# Altium project EVK-NORA-W1.PrjPcb (part 2 of 3)

## Sheet EVK-NORA-W1_SCHEM_0003_Shield_Conn.SchDoc
size B; Date: 7/24/2020; CompanyName: U-blox; DrawnBy: EMOO; Engineer: EMOO; Organization: U-blox; Address1: 3950 Fairview Industrial Dr SE #100; Address2: Salem, OR 97302; SheetNumber: 5; SheetTotal: 6; SheetSize: B; SheetTitle: Connectors
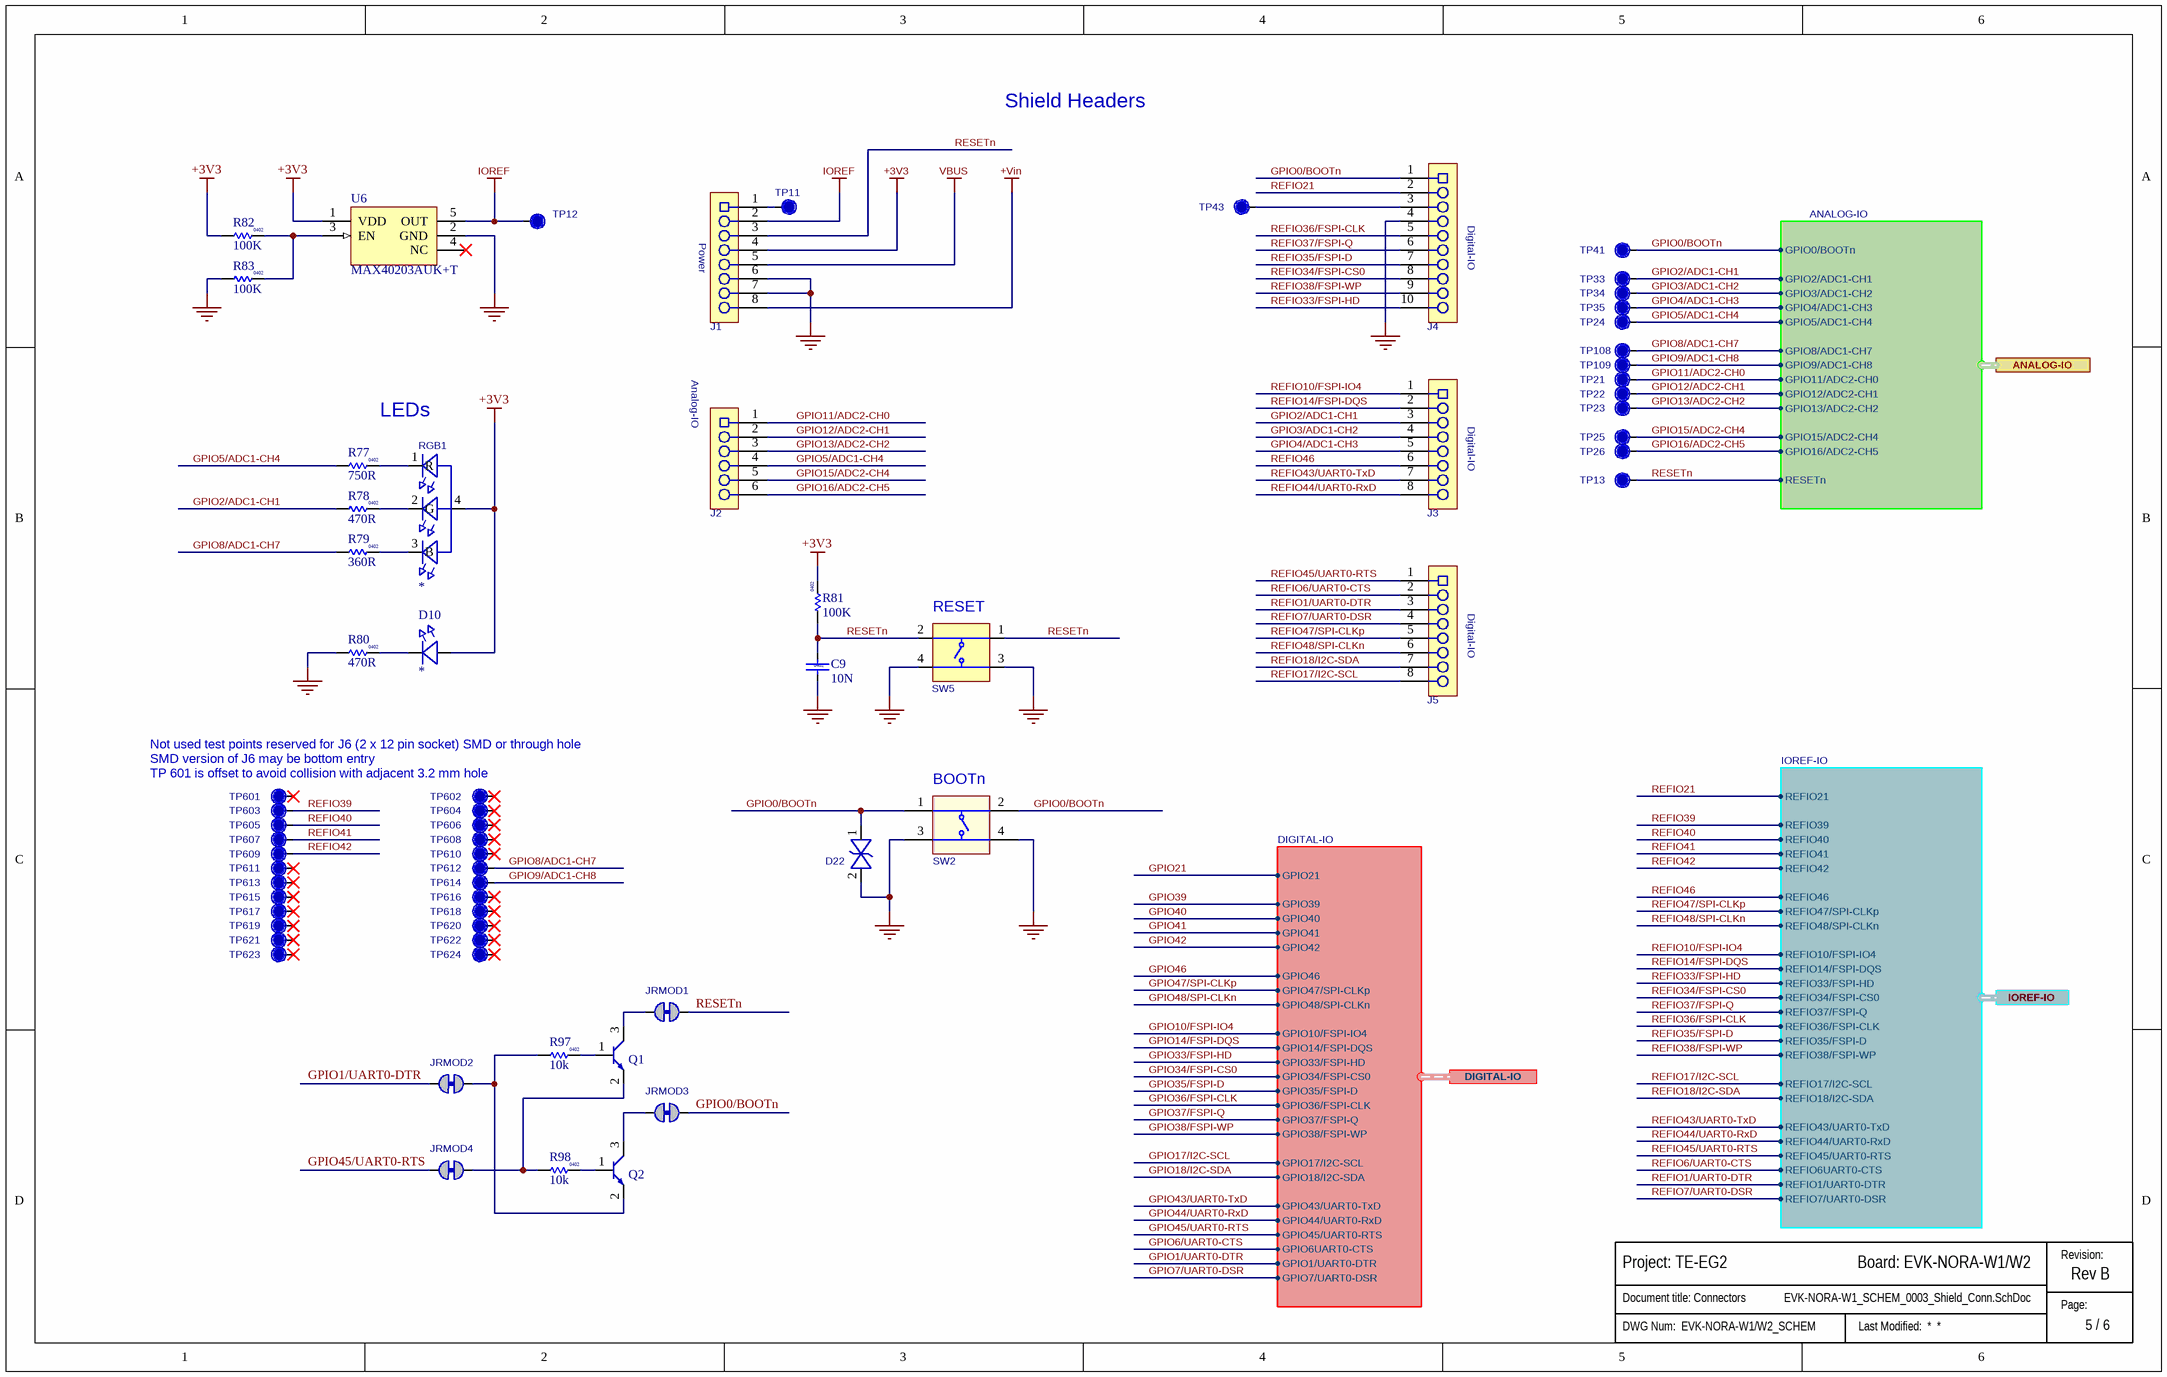
[diagram p3: EVK-NORA-W1_SCHEM_0003_Shield_Conn.SchDoc]

### Parts
(Parts that share a designator on the sheet are numbered #1, #2 ... from top to bottom, then left to right.)
?#5  (no value)  (graphical)
C9  value 10N  Size: 0402  [Cap 0402]
D10  (no value)  [LED-0603]
D22  110-00019  [SOD-923]  (value not drawn)
J1  (no value)  [SKT-0.1P-SSM-108-L-SV]
J2  (no value)  [SKT-0.1P-SSM-106-L-SV]
J3  (no value)  [SKT-0.1P-SSM-108-L-SV]
J4  (no value)  [SKT-0.1P-SSM-110-L-SV]
J5  (no value)  [SKT-0.1P-SSM-108-L-SV]
JRMOD1  Solderbridge-ShortDNP  [Solderbridge-Short]  (value not drawn)  (net tie, no BOM)
JRMOD2  Solderbridge-ShortDNP  [Solderbridge-Short]  (value not drawn)  (net tie, no BOM)
JRMOD3  Solderbridge-ShortDNP  [Solderbridge-Short]  (value not drawn)  (net tie, no BOM)
JRMOD4  Solderbridge-ShortDNP  [Solderbridge-Short]  (value not drawn)  (net tie, no BOM)
Q1  (no value)  [SOT-23]
Q2  (no value)  [SOT-23]
R77  value 750R  Size: 0402  [RES 0402 HD]
R78  value 470R  Size: 0402  [RES 0402 HD]
R79  value 360R  Size: 0402  [RES 0402 HD]
R80  value 470R  Size: 0402  [RES 0402 HD]
R81  value 100K  Size: 0402  [RES 0402 HD]
R82  value 100K  Size: 0402  [RES 0402 HD]
R83  value 100K  Size: 0402  [RES 0402 HD]
R97  value 10k  Size: 0402  [RES 0402 HD]
R98  value 10k  Size: 0402  [RES 0402 HD]
RGB1  (no value)  [LED_1616]
SW2  (no value)  [SW_TACT_SMT_6mm]
SW5  135-00002  [SW_TACT_SMT_6mm]  (value not drawn)
TP11  TP  [TP10R]  (value not drawn)  (no BOM)
TP12  TP  [TP10R]  (value not drawn)  (no BOM)
TP13  TP  [TP10R]  (value not drawn)  (no BOM)
TP21  TP  [TP10R]  (value not drawn)  (no BOM)
TP22  TP  [TP10R]  (value not drawn)  (no BOM)
TP23  TP  [TP10R]  (value not drawn)  (no BOM)
TP24  TP  [TP10R]  (value not drawn)  (no BOM)
TP25  TP  [TP10R]  (value not drawn)  (no BOM)
TP26  TP  [TP10R]  (value not drawn)  (no BOM)
TP33  TP  [TP10R]  (value not drawn)  (no BOM)
TP34  TP  [TP10R]  (value not drawn)  (no BOM)
TP35  TP  [TP10R]  (value not drawn)  (no BOM)
TP41  TP  [TP10R]  (value not drawn)  (no BOM)
TP43  TP  [TP10R]  (value not drawn)  (no BOM)
TP108  TP  [TP10R]  (value not drawn)  (no BOM)
TP109  TP  [TP10R]  (value not drawn)  (no BOM)
TP601  TP  [TP10R]  (value not drawn)  (no BOM)
TP602  TP  [TP10R]  (value not drawn)  (no BOM)
TP603  TP  [TP10R]  (value not drawn)  (no BOM)
TP604  TP  [TP10R]  (value not drawn)  (no BOM)
TP605  TP  [TP10R]  (value not drawn)  (no BOM)
TP606  TP  [TP10R]  (value not drawn)  (no BOM)
TP607  TP  [TP10R]  (value not drawn)  (no BOM)
TP608  TP  [TP10R]  (value not drawn)  (no BOM)
TP609  TP  [TP10R]  (value not drawn)  (no BOM)
TP610  TP  [TP10R]  (value not drawn)  (no BOM)
TP611  TP  [TP10R]  (value not drawn)  (no BOM)
TP612  TP  [TP10R]  (value not drawn)  (no BOM)
TP613  TP  [TP10R]  (value not drawn)  (no BOM)
TP614  TP  [TP10R]  (value not drawn)  (no BOM)
TP615  TP  [TP10R]  (value not drawn)  (no BOM)
TP616  TP  [TP10R]  (value not drawn)  (no BOM)
TP617  TP  [TP10R]  (value not drawn)  (no BOM)
TP618  TP  [TP10R]  (value not drawn)  (no BOM)
TP619  TP  [TP10R]  (value not drawn)  (no BOM)
TP620  TP  [TP10R]  (value not drawn)  (no BOM)
TP621  TP  [TP10R]  (value not drawn)  (no BOM)
TP622  TP  [TP10R]  (value not drawn)  (no BOM)
TP623  TP  [TP10R]  (value not drawn)  (no BOM)
TP624  TP  [TP10R]  (value not drawn)  (no BOM)
U6  Manufacturer Part Number 1: MAX40203AUK+T  [SOT-23-5]

### Ports
ANALOG-IO (harness ANALOG-IO), DIGITAL-IO (harness DIGITAL-IO), IOREF-IO (harness IOREF-IO)

### Harnesses
ANALOG-IO: GPIO0/BOOTn, GPIO11/ADC2-CH0, GPIO12/ADC2-CH1, GPIO13/ADC2-CH2, GPIO15/ADC2-CH4, GPIO16/ADC2-CH5, GPIO2/ADC1-CH1, GPIO3/ADC1-CH2, GPIO4/ADC1-CH3, GPIO5/ADC1-CH4, GPIO8/ADC1-CH7, GPIO9/ADC1-CH8, RESETn
IOREF-IO: REFIO1/UART0-DTR, REFIO10/FSPI-IO4, REFIO14/FSPI-DQS, REFIO17/I2C-SCL, REFIO18/I2C-SDA, REFIO21, REFIO33/FSPI-HD, REFIO34/FSPI-CS0, REFIO37/FSPI-Q, REFIO36/FSPI-CLK, REFIO35/FSPI-D, REFIO38/FSPI-WP, REFIO39, REFIO40, REFIO41, REFIO42, REFIO43/UART0-TxD, REFIO44/UART0-RxD, REFIO45/UART0-RTS, REFIO46, REFIO47/SPI-CLKp, REFIO48/SPI-CLKn, REFIO6UART0-CTS, REFIO7/UART0-DSR
DIGITAL-IO: GPIO1/UART0-DTR, GPIO6UART0-CTS, GPIO7/UART0-DSR, GPIO10/FSPI-IO4, GPIO14/FSPI-DQS, GPIO17/I2C-SCL, GPIO18/I2C-SDA, GPIO21, GPIO33/FSPI-HD, GPIO34/FSPI-CS0, GPIO35/FSPI-D, GPIO36/FSPI-CLK, GPIO37/FSPI-Q, GPIO38/FSPI-WP, GPIO39, GPIO40, GPIO41, GPIO42, GPIO43/UART0-TxD, GPIO44/UART0-RxD, GPIO45/UART0-RTS, GPIO46, GPIO47/SPI-CLKp, GPIO48/SPI-CLKn

### Nets
+3V3: D10.2(A) J1.4 R81.2 R82.1 RGB1.4(A) U6.1(VDD)
+Vin: J1.8
GND: C9.2 D22.2 J1.6 J1.7 J4.4 R80.1 R83.1 SW2.3 SW2.4 SW5.3(T3) SW5.4(T3) U6.2(GND)
IOREF: J1.2 TP12.1 U6.5(OUT)
VBUS: J1.5
GPIO0/BOOTn: D22.1 J4.1 JRMOD3.1 SW2.1 SW2.2 TP41.1 ; port ANALOG-IO.GPIO0/BOOTn
GPIO1/UART0-DTR: JRMOD2.2 ; port DIGITAL-IO.GPIO1/UART0-DTR
GPIO2/ADC1-CH1: J3.3 R78.1 TP33.1 ; port ANALOG-IO.GPIO2/ADC1-CH1
GPIO3/ADC1-CH2: J3.4 TP34.1 ; port ANALOG-IO.GPIO3/ADC1-CH2
GPIO4/ADC1-CH3: J3.5 TP35.1 ; port ANALOG-IO.GPIO4/ADC1-CH3
GPIO5/ADC1-CH4: J2.4 R77.1 TP24.1 ; port ANALOG-IO.GPIO5/ADC1-CH4
GPIO8/ADC1-CH7: R79.1 TP108.1 TP612.1 ; port ANALOG-IO.GPIO8/ADC1-CH7
GPIO9/ADC1-CH8: TP109.1 TP614.1 ; port ANALOG-IO.GPIO9/ADC1-CH8
GPIO11/ADC2-CH0: J2.1 TP21.1 ; port ANALOG-IO.GPIO11/ADC2-CH0
GPIO12/ADC2-CH1: J2.2 TP22.1 ; port ANALOG-IO.GPIO12/ADC2-CH1
GPIO13/ADC2-CH2: J2.3 TP23.1 ; port ANALOG-IO.GPIO13/ADC2-CH2
GPIO15/ADC2-CH4: J2.5 TP25.1 ; port ANALOG-IO.GPIO15/ADC2-CH4
GPIO16/ADC2-CH5: J2.6 TP26.1 ; port ANALOG-IO.GPIO16/ADC2-CH5
GPIO45/UART0-RTS: JRMOD4.2 ; port DIGITAL-IO.GPIO45/UART0-RTS
REFIO1/UART0-DTR: J5.3 ; port IOREF-IO.REFIO1/UART0-DTR
REFIO6/UART0-CTS: J5.2 ; port IOREF-IO.REFIO6UART0-CTS
REFIO7/UART0-DSR: J5.4 ; port IOREF-IO.REFIO7/UART0-DSR
REFIO10/FSPI-IO4: J3.1 ; port IOREF-IO.REFIO10/FSPI-IO4
REFIO14/FSPI-DQS: J3.2 ; port IOREF-IO.REFIO14/FSPI-DQS
REFIO17/I2C-SCL: J5.8 ; port IOREF-IO.REFIO17/I2C-SCL
REFIO18/I2C-SDA: J5.7 ; port IOREF-IO.REFIO18/I2C-SDA
REFIO21: J4.2 ; port IOREF-IO.REFIO21
REFIO33/FSPI-HD: J4.10 ; port IOREF-IO.REFIO33/FSPI-HD
REFIO34/FSPI-CS0: J4.8 ; port IOREF-IO.REFIO34/FSPI-CS0
REFIO35/FSPI-D: J4.7 ; port IOREF-IO.REFIO35/FSPI-D
REFIO36/FSPI-CLK: J4.5 ; port IOREF-IO.REFIO36/FSPI-CLK
REFIO37/FSPI-Q: J4.6 ; port IOREF-IO.REFIO37/FSPI-Q
REFIO38/FSPI-WP: J4.9 ; port IOREF-IO.REFIO38/FSPI-WP
REFIO39: TP603.1 ; port IOREF-IO.REFIO39
REFIO40: TP605.1 ; port IOREF-IO.REFIO40
REFIO41: TP607.1 ; port IOREF-IO.REFIO41
REFIO42: TP609.1 ; port IOREF-IO.REFIO42
REFIO43/UART0-TxD: J3.7 ; port IOREF-IO.REFIO43/UART0-TxD
REFIO44/UART0-RxD: J3.8 ; port IOREF-IO.REFIO44/UART0-RxD
REFIO45/UART0-RTS: J5.1 ; port IOREF-IO.REFIO45/UART0-RTS
REFIO46: J3.6 ; port IOREF-IO.REFIO46
REFIO47/SPI-CLKp: J5.5 ; port IOREF-IO.REFIO47/SPI-CLKp
REFIO48/SPI-CLKn: J5.6 ; port IOREF-IO.REFIO48/SPI-CLKn
RESETn: C9.1 J1.3 JRMOD1.1 R81.1 SW5.1(T1) SW5.2(T2) TP13.1 ; port ANALOG-IO.RESETn
NetD10_1: D10.1(C) R80.2
NetJ1_1: J1.1 TP11.1
NetJ4_3: J4.3 TP43.1
NetJRMOD1_2: JRMOD1.2 Q1.3(C)
NetJRMOD2_1: JRMOD2.1 Q2.2(E) R97.1
NetJRMOD3_2: JRMOD3.2 Q2.3(C)
NetJRMOD4_1: JRMOD4.1 Q1.2(E) R98.1
NetQ1_1: Q1.1(B) R97.2
NetQ2_1: Q2.1(B) R98.2
NetR77_2: R77.2 RGB1.1(R)
NetR78_2: R78.2 RGB1.2(G)
NetR79_2: R79.2 RGB1.3(B)
NetR82_2: R82.2 R83.2 U6.3(EN)

Not connected (* = marked no-connect by the designer): TP601 1*; TP602 1*; TP604 1*; TP606 1*; TP608 1*; TP610 1*; TP611 1*; TP613 1*; TP615 1*; TP616 1*; TP617 1*; TP618 1*; TP619 1*; TP620 1*; TP621 1*; TP622 1*; TP623 1*; TP624 1*; U6 4(NC)*

### Notes on the sheet
- Shield Headers
- (near J1) Power
- (near J4) Digital-IO
- LEDs
- (near J2) Analog-IO
- (near J3) Digital-IO
- (near SW5) RESET
- (near J5) Digital-IO
- Not used test points reserved for J6 (2 x 12 pin socket) SMD or through hole
- SMD version of J6 may be bottom entry
- TP 601 is offset to avoid collision with adjacent 3.2 mm hole
- (near SW2) BOOTn
- Revision:
- Page:

### Library data of the parts
?#5 = Sub_Title_Block: as ?#3 on sheet EVK-NORA-W1_SCHEM_0001_NORA_W1_Module
C9 = UBXH01-0023025: CAP CER X7R 0402 10N 10% 16V; Manufacturer: Murata Manufacturing Company, Ltd.; Manufacturer P/N: GRM155R71C103KA01; Editor: roland.rust; Released by: anthony.gergis; Env: ROHS; Permitted Use: Volume Products; Perferred: PREF; Mfg P/N Status: NRND; Mfg P/N Split: 100; Mfg P/N Released: Yes; Part Number: UBXH01-0023025; Tolerance: 10%; Max Voltage: 16V; Min Operating Temp: -55°C; Max Operating Temp: 125°C; Part Type: Capacitor; Release Data: 2021-02-16 13:14:11.218378; UBX Wiki: https://wiki.u-blox.com/bin/view/Operations/PartDetails?index=5491; RefDes: C; Manufacturer 2: Samsung Electro-Mechanics; Manufacturer P/N 2: CL05B103KO5NNNC; Mfg P/N Status 2: Active; Mfg P/N Split 2: 0; Mfg P/N Released 2: Yes; Mfg P/N Datasheet 2: https://wiki.u-blox.com/bin/view/Generic/Docs/DocumentSummary?index=28567
D10 = UBXH11-0000018: LED CHIP 0603 LOW CURRENT OSRAM 0.002A GREEN 2.2V 2mA; Manufacturer P/N: LG L29K-G2J1-24; Editor: johann.furrer; Released by: martin.grasse; Env: ROHS; Permitted Use: Volume Products; Perferred: PREF; Mfg P/N Status: Active; Mfg P/N Split: 100; Mfg P/N Released: Yes; Color: *; Part Number: UBXH11-0000018; Value: GREEN; Max Voltage: 2.2V; Max Current: 2mA; Size: 0603; Min Operating Temp: -40°C; Max Operating Temp: 85°C; Part Type: LED; Release Data: 2018-01-09 15:31:38.754561; UBX Wiki: https://wiki.u-blox.com/bin/view/Operations/PartDetails?index=20619; RefDes: DS; Manufacturer: Osram; Mfg P/N Datasheet: https://wiki.u-blox.com/bin/view/Generic/Docs/DocumentSummary?index=20620
D22 = 110-00019: ESD9B3.3ST5G; Part Name: Diode TVS 3.3V SOD-923; Part_Type: Diode; Manufacturer: ON Semiconductor; Item_Phase: Preliminary; Body Size: 0.8mm x 0.6mm; Component Mounting Type: SMT; Diode Type: TVS; Use in new designs: Yes; Voltage: 3.3V; Part Number: 110-00019; Manufacturer P/N: ESD9B3.3ST5G; Supplier 1: Digi-Key; Supplier Part Number 1: ESD9B3.3ST5GOSCT-ND; Arena Link: https://app.bom.com/a/4M5DJQ9Q9SR7DV4H?v=spec.summary; Height: 0.4mm; MFG Package: SOD-923; Package Type: SOD; Pins: 2
J1 J3 J5 = 130-00102: Socket Strip 0.1" 8 Pin 1Row SMD Black; Manufacturer 1: Seeed Technology; Manufacturer Part Number 1: Rigado 130-00102; Part Name: CON SKT Strip 0.1" 8Pin 1Row SMD Black; Item Phase: In Production; Use in new designs: Yes; Voltage: 572VDC; UBX Code: None; Part Number: 130-00102; Supplier 1: Seeed Technology; Supplier Part Number 1: Rigado 130-00102; Diameter: None; Height: 7.37mm; Max Operating Temp: 105; Min Operating Temp: -55; Pins: 8; Revision: 0C; Manufacturer 2: Samtec; Manufacturer Part Number 2: SSM-108-F-SV-P-TR; Supplier 2: Avnet; Supplier Part Number 2: SSM-108-F-SV-P-TR
J2 = 130-00103: Socket Strip 0.1" 6Pin 1Row SMD Black; Manufacturer 1: Seeed Technology; Manufacturer Part Number 1: Rigado 130-00103; Part Name: CON SKT Strip 0.1" 6Pin 1Row SMD Black; Item Phase: In Production; Use in new designs: Yes; Voltage: 572VDC; UBX Code: None; Manufacturer P/N: *; Part Number: 130-00103; Supplier 1: Seeed Technology; Supplier Part Number 1: Rigado 130-00103; Diameter: None; Height: 7.37mm; Max Operating Temp: 105; Min Operating Temp: -55; Pins: 6; Revision: 0C; Manufacturer 2: Samtec; Manufacturer Part Number 2: SSM-106-F-SV-P-TR; Supplier 2: Avnet; Supplier Part Number 2: SSM-106-F-SV-P-TR
J4 = 130-00101: Socket Strip 0.1" 10Pin 1Row SMD Black; Manufacturer 1: Seeed Technology; Manufacturer Part Number 1: Rigado 130-00101; Part Name: CON SKT Strip 0.1" 10Pin 1Row SMD Black; Item Phase: In Production; Use in new designs: Yes; Voltage: 572VDC; UBX Code: None; Part Number: 130-00101; Supplier 1: Seeed Technology; Supplier Part Number 1: Rigado 130-00101; Diameter: None; Height: 7.37mm; Max Operating Temp: 105; Min Operating Temp: -55; Pins: 10; Revision: 0C; Manufacturer 2: Samtec; Manufacturer Part Number 2: SSM-110-F-SV-P-TR; Supplier 2: Avnet; Supplier Part Number 2: SSM-110-F-SV-P-TR
JRMOD1-JRMOD4 = Solderbridge-Short: Added By: Paul B; Part Number: Solderbridge-Short; Height: 0; DNP: DNP; Added Date: 12/2/2015
Q1 Q2 = UBXH20-0000052: GENERAL PURPOSE SINGLE NPN TRANSISTOR SOT-23 45V 800mA; Manufacturer: ON Semiconductor; Value: BCW66GLT3G; Editor: jaakko.jussila; Released by: alex.claville; Env: ROHS; Permitted Use: Support Products; Perferred: PREF; Mfg P/N Status: Active; Mfg P/N Split: 100; Mfg P/N Released: Yes; Part Number: UBXH20-0000052; Max Voltage: 45V; Max Current: 800mA; Min Operating Temp: -55°C; Max Operating Temp: 155°C; Part Type: Transistor; Release Data: 2019-05-06T10:58:51; UBX Wiki: https://wiki.u-blox.com/bin/view/Operations/PartDetails?index=26834; RefDes: Q; Manufacturer P/N: BCW66GLT3G; Mfg P/N Datasheet: https://wiki.u-blox.com/bin/view/Generic/Docs/DocumentSummary?index=26837
R77 = UBXH18-0008046: RES THICK FILM CHIP 0402 750R 5% 100mW; Manufacturer: Panasonic; Manufacturer P/N: ERJ2GEJ751X; Editor: jaka.bevk; Released by: erian.bezhani; Env: ROHS; Permitted Use: Volume Products; Perferred: PREF; Mfg P/N Status: Active; Mfg P/N Split: 100; Mfg P/N Released: Yes; Part Number: UBXH18-0008046; Tolerance: 5%; Max Power: 100mW; Part Type: Resistor; Release Data: 2014-10-03 09:31:33.687559; UBX Wiki: https://wiki.u-blox.com/bin/view/Operations/PartDetails?index=6935; RefDes: R; Mfg P/N Datasheet: https://wiki.u-blox.com/bin/view/Generic/Docs/DocumentSummary?index=21267
R78 R80 = UBXH18-0008041: RES THICK FILM CHIP 0402 470R 5% 100mW; Manufacturer: ROHM; Manufacturer P/N: MCR01MZPJ471; Editor: roland.rust; Env: ROHS; Permitted Use: Volume Products; Perferred: PREF; Mfg P/N Status: Active; Mfg P/N Split: 100; Mfg P/N Released: Yes; Part Number: UBXH18-0008041; Tolerance: 5%; Max Power: 100mW; Part Type: Resistor; Released by: roland.rust; Release Data: 2009-04-24 14:36:39; UBX Wiki: https://wiki.u-blox.com/bin/view/Operations/PartDetails?index=6926; RefDes: R; Manufacturer 2: KOA; Manufacturer P/N 2: RK73B1ETTP471J; Mfg P/N Status 2: Active; Mfg P/N Split 2: 0; Mfg P/N Released 2: Yes; Manufacturer 3: YAGEO; Manufacturer P/N 3: 2322_705_87471_L; Mfg P/N Status 3: NRND; Mfg P/N Split 3: 0; Mfg P/N Released 3: Yes
R79 = UBXH18-0000216: RES THICK FILM CHIP 0402 360R 1% 63mW; Manufacturer: KOA; Manufacturer P/N: RK73H1ETTP3600F; Editor: michael.hein; Released by: vasyl.dykyy; Env: ROHS; Permitted Use: Volume Products; Perferred: PREF; Mfg P/N Status: Active; Mfg P/N Split: 100; Mfg P/N Released: Yes; Part Number: UBXH18-0000216; Tolerance: 1%; Max Power: 63mW; Part Type: Resistor; Release Data: 2015-10-02 11:55:45.476057; Automotive: Yes; UBX Wiki: https://wiki.u-blox.com/bin/view/Operations/PartDetails?index=23306; RefDes: R; Mfg P/N Datasheet: https://wiki.u-blox.com/bin/view/Generic/Docs/DocumentSummary?index=8222
R81-R83 = UBXH18-0008097: RES THICK FILM CHIP 0402 100K 5% 100mW; Manufacturer: YAGEO; Manufacturer P/N: 2322_705_70104_L; Editor: roland.rust; Env: ROHS; Permitted Use: Volume Products; Perferred: PREF; Mfg P/N Status: NRND; Mfg P/N Split: 100; Mfg P/N Released: Yes; Part Number: UBXH18-0008097; Tolerance: 5%; Max Power: 100mW; Part Type: Resistor; Released by: roland.rust; Release Data: 2005-07-22 13:59:44; UBX Wiki: https://wiki.u-blox.com/bin/view/Operations/PartDetails?index=7020; RefDes: R; Manufacturer 2: KOA; Manufacturer P/N 2: RK73B1ETTD104J; Mfg P/N Status 2: NRND; Mfg P/N Split 2: 0; Mfg P/N Released 2: Yes
R97 R98 = 180-00024: Resistor 10k ohm 1% 1/16W, 0402; Manufacturer 1: Samsung Electro-Mechanics America, Inc; Manufacturer Part Number 1: RC1005F103CS; Part Name: RES SMD 10K OHM 1% 1/16W 0402; Item Phase: In Production; Tolerance: +/- 1%; Use in new designs: Yes; UBX Code: None; Part Number: 180-00024; Supplier 1: Digi-Key; Supplier Part Number 1: 1276-3431-1-ND; Manufacturer 2: Hong Kong Resistors Manufactory; Manufacturer Part Number 2: RCT0210KFLF; Supplier 2: None; Supplier Part Number 2: None; Height: 0.4mm; Max Operating Temp: 155; Min Operating Temp: -55; Pins: 2; Power: 1/16W; Revision: 0E; Voltage: N/A
RGB1 = 115-00026: LED RGB SMT 0606; Manufacturer 1: Lite-On Inc; Manufacturer Part Number 1: LTST-C19HE1WT; Body Size: 1.6mm x 1.6mm; Current: 20mA; Item Phase: In Production; MFG Package: 0606; Use in new designs: Yes; Voltage: None; Color: *; Part Number: 115-00026; Supplier 1: Digi-Key; Supplier Part Number 1: 160-2162-1-ND; Height: 0.35mm; Max Operating Temp: 80; Min Operating Temp: -20; Part Name: LED RGB SMT 0606; Pins: 4; Revision: 0B; Size: Other; UBX Code: None; Supplier 2: Digi-Key; Supplier Part Number 2: 1516-1184-1-ND
SW2 = 135-00002: Tactile Switch, SPST-NO, SMT, Actuation force = 160g, 6mm x 6mm; Part Name: Button Tactile SPST-NO 50mA 6mm SMT; Part_Type: Button; Manufacturer: C&K Components; Manufacturer P/N: PTS645SM43SMTR92 LFS; Item_Phase: Production; Current: 50mA; Switch/Button Circuit: SPST; Switch/Button Function: Off-Mom; Use in new designs: Yes; Voltage: 12VDC; Part Number: 135-00002; Supplier 1: Digi-Key; Supplier Part Number 1: CKN9112CT-ND; Arena Link: https://app.bom.com/a/L3MU07Q7Q98QQQW6?v=spec.summary; Body Size: 6mm x 6mm; Component Mounting Type: SMT; Height: 4.4mm; Pins: 4; Revision: 0B; Manufacturer 2: Seeed Technology; Manufacturer P/N 2: Rigado 135-00002; Supplier 2: Seeed Technology; Supplier Part Number 2: Rigado 135-00002
SW5 = 135-00002: Tactile Switch, SPST-NO, SMT 160gf.; Part Name: Button Tactile SPST-NO 50mA 6mm SMT; Part_Type: Button; Manufacturer: C&K Components; Manufacturer P/N: PTS645SM43SMTR92 LFS; Item_Phase: Preliminary; Body Size: 6mm x 6mm; Current: 50mA; Switch/Button Circuit: SPST; Switch/Button Function: Off-Mom; Use in new designs: Yes; Voltage: 12VDC; Part Number: 135-00002; Supplier 1: Digi-Key; Supplier Part Number 1: CKN9112CT-ND; Arena Link: https://app.bom.com/a/L3MU07Q7Q98QQQW6?v=spec.summary; Component Mounting Type: SMT; Height: 4.3mm; Pins: 4
TP11-TP13 TP21-TP26 TP33-TP35 TP41 TP43 TP108 TP109 TP601-TP624 = TP10R: as TP1 on sheet EVK-NORA-W1_SCHEM_0001_NORA_W1_Module; Part Number: TP10R; Size: 1.0mm; Height: 0; DNP: DNP; Added Date: 2/1/2015; Checked By: Paul B; Checked Date: 2/5/2015
U6 = 265-00058: Ideal Diode - OR Controller Source Selector Switch P-Channel 1:1 SOT-23-5; Manufacturer 1: Maxim Integrated Products; Item_Phase: Preliminary; Body Size: None; Component Mounting Type: SMT; Current: 1A; SMT Pitch: 0.95mm; Use in new designs: Yes; Voltage: 5.5V; Interface: Discrete; Item Phase: Unreleased; Reg Outputs: 1xLoad Switch; Part Number: 265-00058; Part Name: MAX40203AUK; Part_Type: Ideal Diode; Supplier 1: Digi-Key; Supplier Part Number 1: 175-MAX40203AUK+TTR-ND; Height: None; MFG Package: SOT-23-5; Package Type: SOT-23-5; Pins: 5; HelpURL: https://datasheets.maximintegrated.com/en/ds/MAX40203.pdf; Application: Power Switch; Max Operating Temp: 85; Min Operating Temp: -40; Revision: None; Thermal Pad: None; UBX Code: None; Manufacturer 2: None; Manufacturer Part Number 2: None; Supplier 2: None; Supplier Part Number 2: None

## Sheet EVK-NORA-W1_SCHEM_0005_Interface_Isolation.SchDoc
size B; Date: 7/24/2020; CompanyName: U-blox; DrawnBy: EMOO; Engineer: EMOO; Organization: U-blox; Address1: 3950 Fairview Industrial Dr SE #100*; Address2: Salem, OR 97302; SheetNumber: 4; SheetTotal: 6; SheetSize: B; SheetTitle: Interface MCU
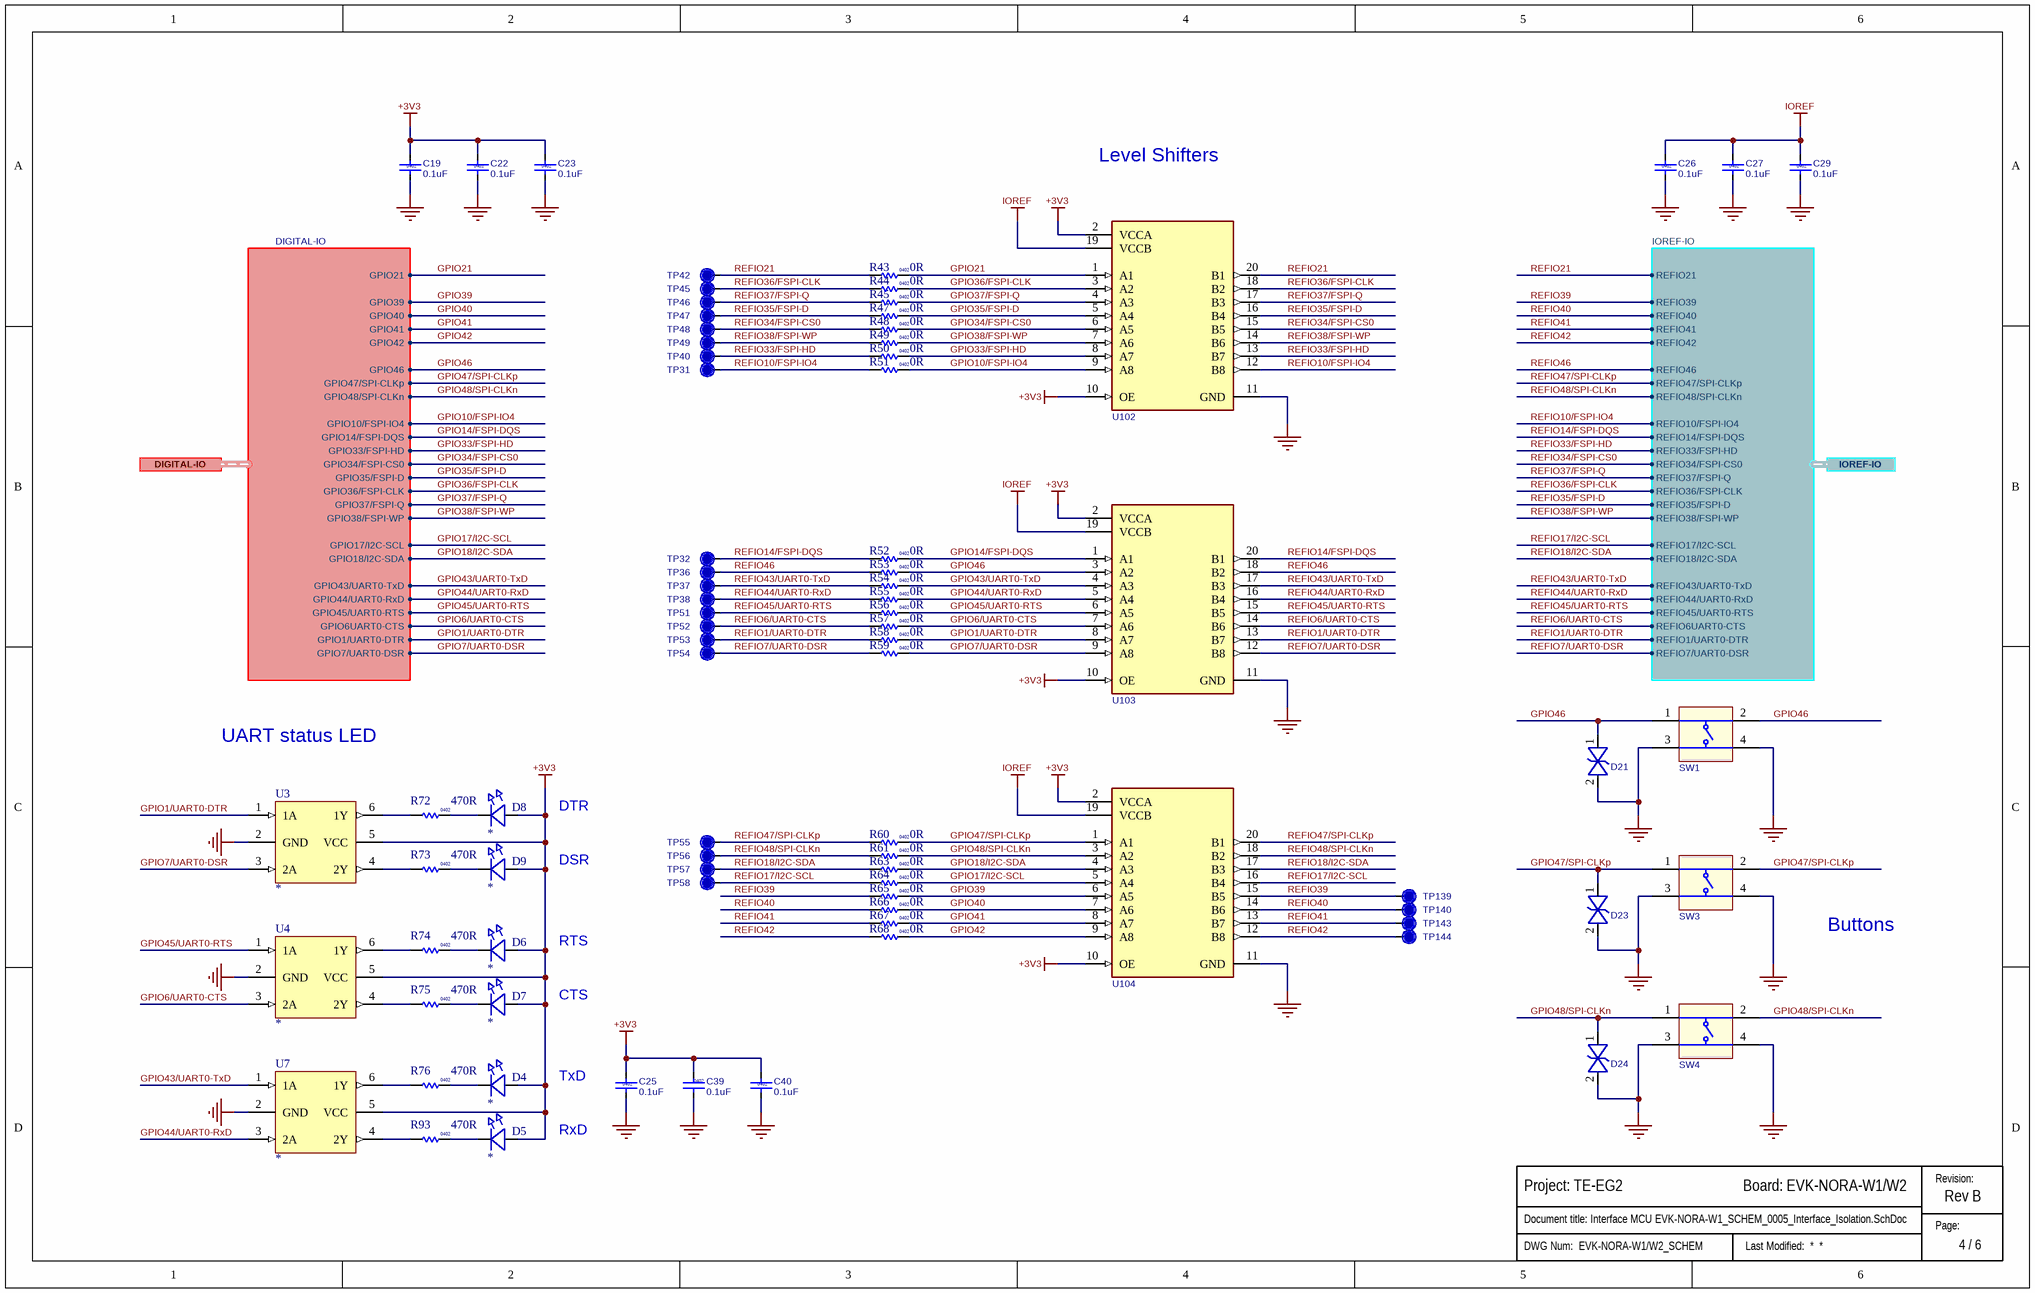
[diagram p4: EVK-NORA-W1_SCHEM_0005_Interface_Isolation.SchDoc]

### Parts
(Parts that share a designator on the sheet are numbered #1, #2 ... from top to bottom, then left to right.)
?#6  (no value)  (graphical)
C19  value 0.1uF  Size: 0402  [Cap 0402 HD]  (hidden comment: 120-000160.1uF)
C22  value 0.1uF  Size: 0402  [Cap 0402 HD]  (hidden comment: 120-000160.1uF)
C23  value 0.1uF  Size: 0402  [Cap 0402 HD]  (hidden comment: 120-000160.1uF)
C25  value 0.1uF  Size: 0402  [Cap 0402 HD]  (hidden comment: 120-000160.1uF)
C26  value 0.1uF  Size: 0402  [Cap 0402 HD]  (hidden comment: 120-000160.1uF)
C27  value 0.1uF  Size: 0402  [Cap 0402 HD]  (hidden comment: 120-000160.1uF)
C29  value 0.1uF  Size: 0402  [Cap 0402 HD]  (hidden comment: 120-000160.1uF)
C39  value 0.1uF  Size: 0402  [Cap 0402 HD]  (hidden comment: 120-000160.1uF)
C40  value 0.1uF  Size: 0402  [Cap 0402 HD]  (hidden comment: 120-000160.1uF)
D4  (no value)  [LED-0603]
D5  (no value)  [LED-0603]
D6  (no value)  [LED-0603]
D7  (no value)  [LED-0603]
D8  (no value)  [LED-0603]
D9  (no value)  [LED-0603]
D21  110-00019  [SOD-923]  (value not drawn)
D23  110-00019  [SOD-923]  (value not drawn)
D24  110-00019  [SOD-923]  (value not drawn)
R43  value 0R  Size: 0402  [RES 0402 HD]
R44  value 0R  Size: 0402  [RES 0402 HD]
R45  value 0R  Size: 0402  [RES 0402 HD]
R47  value 0R  Size: 0402  [RES 0402 HD]
R48  value 0R  Size: 0402  [RES 0402 HD]
R49  value 0R  Size: 0402  [RES 0402 HD]
R50  value 0R  Size: 0402  [RES 0402 HD]
R51  value 0R  Size: 0402  [RES 0402 HD]
R52  value 0R  Size: 0402  [RES 0402 HD]
R53  value 0R  Size: 0402  [RES 0402 HD]
R54  value 0R  Size: 0402  [RES 0402 HD]
R55  value 0R  Size: 0402  [RES 0402 HD]
R56  value 0R  Size: 0402  [RES 0402 HD]
R57  value 0R  Size: 0402  [RES 0402 HD]
R58  value 0R  Size: 0402  [RES 0402 HD]
R59  value 0R  Size: 0402  [RES 0402 HD]
R60  value 0R  Size: 0402  [RES 0402 HD]
R61  value 0R  Size: 0402  [RES 0402 HD]
R63  value 0R  Size: 0402  [RES 0402 HD]
R64  value 0R  Size: 0402  [RES 0402 HD]
R65  value 0R  Size: 0402  [RES 0402 HD]
R66  value 0R  Size: 0402  [RES 0402 HD]
R67  value 0R  Size: 0402  [RES 0402 HD]
R68  value 0R  Size: 0402  [RES 0402 HD]
R72  value 470R  Size: 0402  [RES 0402 HD]
R73  value 470R  Size: 0402  [RES 0402 HD]
R74  value 470R  Size: 0402  [RES 0402 HD]
R75  value 470R  Size: 0402  [RES 0402 HD]
R76  value 470R  Size: 0402  [RES 0402 HD]
R93  value 470R  Size: 0402  [RES 0402 HD]
SW1  (no value)  [SW_TACT_SMT_6mm]
SW3  (no value)  [SW_TACT_SMT_6mm]
SW4  (no value)  [SW_TACT_SMT_6mm]
TP31  TP  [TP10R]  (value not drawn)  (no BOM)
TP32  TP  [TP10R]  (value not drawn)  (no BOM)
TP36  TP  [TP10R]  (value not drawn)  (no BOM)
TP37  TP  [TP10R]  (value not drawn)  (no BOM)
TP38  TP  [TP10R]  (value not drawn)  (no BOM)
TP40  TP  [TP10R]  (value not drawn)  (no BOM)
TP42  TP  [TP10R]  (value not drawn)  (no BOM)
TP45  TP  [TP10R]  (value not drawn)  (no BOM)
TP46  TP  [TP10R]  (value not drawn)  (no BOM)
TP47  TP  [TP10R]  (value not drawn)  (no BOM)
TP48  TP  [TP10R]  (value not drawn)  (no BOM)
TP49  TP  [TP10R]  (value not drawn)  (no BOM)
TP51  TP  [TP10R]  (value not drawn)  (no BOM)
TP52  TP  [TP10R]  (value not drawn)  (no BOM)
TP53  TP  [TP10R]  (value not drawn)  (no BOM)
TP54  TP  [TP10R]  (value not drawn)  (no BOM)
TP55  TP  [TP10R]  (value not drawn)  (no BOM)
TP56  TP  [TP10R]  (value not drawn)  (no BOM)
TP57  TP  [TP10R]  (value not drawn)  (no BOM)
TP58  TP  [TP10R]  (value not drawn)  (no BOM)
TP139  TP  [TP10R]  (value not drawn)  (no BOM)
TP140  TP  [TP10R]  (value not drawn)  (no BOM)
TP143  TP  [TP10R]  (value not drawn)  (no BOM)
TP144  TP  [TP10R]  (value not drawn)  (no BOM)
U3  (no value)  [SC70-6]
U4  (no value)  [SC70-6]
U7  (no value)  [SC70-6]
U102  TXS0108EPWR  [TSSOP-20Pin-6.5x6.4]  (value not drawn)
U103  TXS0108EPWR  [TSSOP-20Pin-6.5x6.4]  (value not drawn)
U104  TXS0108EPWR  [TSSOP-20Pin-6.5x6.4]  (value not drawn)

### Ports
DIGITAL-IO (harness DIGITAL-IO), IOREF-IO (harness IOREF-IO)

### Harnesses
IOREF-IO: REFIO1/UART0-DTR, REFIO10/FSPI-IO4, REFIO14/FSPI-DQS, REFIO17/I2C-SCL, REFIO18/I2C-SDA, REFIO21, REFIO33/FSPI-HD, REFIO34/FSPI-CS0, REFIO37/FSPI-Q, REFIO36/FSPI-CLK, REFIO35/FSPI-D, REFIO38/FSPI-WP, REFIO39, REFIO40, REFIO41, REFIO42, REFIO43/UART0-TxD, REFIO44/UART0-RxD, REFIO45/UART0-RTS, REFIO46, REFIO47/SPI-CLKp, REFIO48/SPI-CLKn, REFIO6UART0-CTS, REFIO7/UART0-DSR
DIGITAL-IO: GPIO1/UART0-DTR, GPIO10/FSPI-IO4, GPIO14/FSPI-DQS, GPIO17/I2C-SCL, GPIO18/I2C-SDA, GPIO21, GPIO33/FSPI-HD, GPIO34/FSPI-CS0, GPIO35/FSPI-D, GPIO36/FSPI-CLK, GPIO37/FSPI-Q, GPIO38/FSPI-WP, GPIO39, GPIO40, GPIO41, GPIO42, GPIO43/UART0-TxD, GPIO44/UART0-RxD, GPIO45/UART0-RTS, GPIO46, GPIO47/SPI-CLKp, GPIO48/SPI-CLKn, GPIO6UART0-CTS, GPIO7/UART0-DSR

### Nets
+3V3: C19.1 C22.1 C23.1 C25.1 C39.1 C40.1 D4.2(A) D5.2(A) D6.2(A) D7.2(A) D8.2(A) D9.2(A) U3.5(VCC) U4.5(VCC) U7.5(VCC) U102.2(VCCA) U102.10(OE) U103.2(VCCA) U103.10(OE) U104.2(VCCA) U104.10(OE)
GND: C19.2 C22.2 C23.2 C25.2 C26.2 C27.2 C29.2 C39.2 C40.2 D21.2 D23.2 D24.2 SW1.3 SW1.4 SW3.3 SW3.4 SW4.3 SW4.4 U3.2(GND) U4.2(GND) U7.2(GND) U102.11(GND) U103.11(GND) U104.11(GND)
IOREF: C26.1 C27.1 C29.1 U102.19(VCCB) U103.19(VCCB) U104.19(VCCB)
GPIO1/UART0-DTR: R58.2 U3.1(1A) U103.8(A7) ; port DIGITAL-IO.GPIO1/UART0-DTR
GPIO6/UART0-CTS: R57.2 U4.3(2A) U103.7(A6) ; port DIGITAL-IO.GPIO6UART0-CTS
GPIO7/UART0-DSR: R59.2 U3.3(2A) U103.9(A8) ; port DIGITAL-IO.GPIO7/UART0-DSR
GPIO10/FSPI-IO4: R51.2 U102.9(A8) ; port DIGITAL-IO.GPIO10/FSPI-IO4
GPIO14/FSPI-DQS: R52.2 U103.1(A1) ; port DIGITAL-IO.GPIO14/FSPI-DQS
GPIO17/I2C-SCL: R64.2 U104.5(A4) ; port DIGITAL-IO.GPIO17/I2C-SCL
GPIO18/I2C-SDA: R63.2 U104.4(A3) ; port DIGITAL-IO.GPIO18/I2C-SDA
GPIO21: R43.2 U102.1(A1) ; port DIGITAL-IO.GPIO21
GPIO33/FSPI-HD: R50.2 U102.8(A7) ; port DIGITAL-IO.GPIO33/FSPI-HD
GPIO34/FSPI-CS0: R48.2 U102.6(A5) ; port DIGITAL-IO.GPIO34/FSPI-CS0
GPIO35/FSPI-D: R47.2 U102.5(A4) ; port DIGITAL-IO.GPIO35/FSPI-D
GPIO36/FSPI-CLK: R44.2 U102.3(A2) ; port DIGITAL-IO.GPIO36/FSPI-CLK
GPIO37/FSPI-Q: R45.2 U102.4(A3) ; port DIGITAL-IO.GPIO37/FSPI-Q
GPIO38/FSPI-WP: R49.2 U102.7(A6) ; port DIGITAL-IO.GPIO38/FSPI-WP
GPIO39: R65.2 U104.6(A5) ; port DIGITAL-IO.GPIO39
GPIO40: R66.2 U104.7(A6) ; port DIGITAL-IO.GPIO40
GPIO41: R67.2 U104.8(A7) ; port DIGITAL-IO.GPIO41
GPIO42: R68.2 U104.9(A8) ; port DIGITAL-IO.GPIO42
GPIO43/UART0-TxD: R54.2 U7.1(1A) U103.4(A3) ; port DIGITAL-IO.GPIO43/UART0-TxD
GPIO44/UART0-RxD: R55.2 U7.3(2A) U103.5(A4) ; port DIGITAL-IO.GPIO44/UART0-RxD
GPIO45/UART0-RTS: R56.2 U4.1(1A) U103.6(A5) ; port DIGITAL-IO.GPIO45/UART0-RTS
GPIO46: D21.1 R53.2 SW1.1 SW1.2 U103.3(A2) ; port DIGITAL-IO.GPIO46
GPIO47/SPI-CLKp: D23.1 R60.2 SW3.1 SW3.2 U104.1(A1) ; port DIGITAL-IO.GPIO47/SPI-CLKp
GPIO48/SPI-CLKn: D24.1 R61.2 SW4.1 SW4.2 U104.3(A2) ; port DIGITAL-IO.GPIO48/SPI-CLKn
REFIO1/UART0-DTR: R58.1 TP53.1 U103.13(B7) ; port IOREF-IO.REFIO1/UART0-DTR
REFIO6/UART0-CTS: R57.1 TP52.1 U103.14(B6) ; port IOREF-IO.REFIO6UART0-CTS
REFIO7/UART0-DSR: R59.1 TP54.1 U103.12(B8) ; port IOREF-IO.REFIO7/UART0-DSR
REFIO10/FSPI-IO4: R51.1 TP31.1 U102.12(B8) ; port IOREF-IO.REFIO10/FSPI-IO4
REFIO14/FSPI-DQS: R52.1 TP32.1 U103.20(B1) ; port IOREF-IO.REFIO14/FSPI-DQS
REFIO17/I2C-SCL: R64.1 TP58.1 U104.16(B4) ; port IOREF-IO.REFIO17/I2C-SCL
REFIO18/I2C-SDA: R63.1 TP57.1 U104.17(B3) ; port IOREF-IO.REFIO18/I2C-SDA
REFIO21: R43.1 TP42.1 U102.20(B1) ; port IOREF-IO.REFIO21
REFIO33/FSPI-HD: R50.1 TP40.1 U102.13(B7) ; port IOREF-IO.REFIO33/FSPI-HD
REFIO34/FSPI-CS0: R48.1 TP48.1 U102.15(B5) ; port IOREF-IO.REFIO34/FSPI-CS0
REFIO35/FSPI-D: R47.1 TP47.1 U102.16(B4) ; port IOREF-IO.REFIO35/FSPI-D
REFIO36/FSPI-CLK: R44.1 TP45.1 U102.18(B2) ; port IOREF-IO.REFIO36/FSPI-CLK
REFIO37/FSPI-Q: R45.1 TP46.1 U102.17(B3) ; port IOREF-IO.REFIO37/FSPI-Q
REFIO38/FSPI-WP: R49.1 TP49.1 U102.14(B6) ; port IOREF-IO.REFIO38/FSPI-WP
REFIO39: R65.1 TP139.1 U104.15(B5) ; port IOREF-IO.REFIO39
REFIO40: R66.1 TP140.1 U104.14(B6) ; port IOREF-IO.REFIO40
REFIO41: R67.1 TP143.1 U104.13(B7) ; port IOREF-IO.REFIO41
REFIO42: R68.1 TP144.1 U104.12(B8) ; port IOREF-IO.REFIO42
REFIO43/UART0-TxD: R54.1 TP37.1 U103.17(B3) ; port IOREF-IO.REFIO43/UART0-TxD
REFIO44/UART0-RxD: R55.1 TP38.1 U103.16(B4) ; port IOREF-IO.REFIO44/UART0-RxD
REFIO45/UART0-RTS: R56.1 TP51.1 U103.15(B5) ; port IOREF-IO.REFIO45/UART0-RTS
REFIO46: R53.1 TP36.1 U103.18(B2) ; port IOREF-IO.REFIO46
REFIO47/SPI-CLKp: R60.1 TP55.1 U104.20(B1) ; port IOREF-IO.REFIO47/SPI-CLKp
REFIO48/SPI-CLKn: R61.1 TP56.1 U104.18(B2) ; port IOREF-IO.REFIO48/SPI-CLKn
NetD4_1: D4.1(C) R76.2
NetD5_1: D5.1(C) R93.2
NetD6_1: D6.1(C) R74.2
NetD7_1: D7.1(C) R75.2
NetD8_1: D8.1(C) R72.2
NetD9_1: D9.1(C) R73.2
NetR72_1: R72.1 U3.6(1Y)
NetR73_1: R73.1 U3.4(2Y)
NetR74_1: R74.1 U4.6(1Y)
NetR75_1: R75.1 U4.4(2Y)
NetR76_1: R76.1 U7.6(1Y)
NetR93_1: R93.1 U7.4(2Y)

### Notes on the sheet
- Level Shifters
- UART status LED
- DTR
- DSR
- RTS
- Buttons
- CTS
- TxD
- RxD
- Revision:
- Page:

### Library data of the parts
?#6 = Sub_Title_Block: Minimized schematic title block for all subset sheets
C19 C22 C23 C25-C27 C29 C39 C40 = 120-00016: Cap, Ceramic 0.1uF 10V 10% X5R 0402; Part Name: CAP CER 0.1UF 10V 10% X5R 0402; Part_Type: Ceramic Capacitor; Manufacturer: Murata Electronics North America; Manufacturer P/N: GRM155R61A104KA01J; Item_Phase: Production; Component Mounting Type: SMT; Tolerance: +/- 10%; Use in new designs: Yes; Part Number: 120-00016; Revision: 0A; Supplier 1: Digi-Key; Supplier Part Number 1: 490-6297-1-ND; Manufacturer 2: Yageo; Manufacturer P/N 2: CC0402KRX5R6BB104; Supplier 2: Digi-Key; Supplier Part Number 2: 311-1336-1-ND; Arena Link: https://app.bom.com/a/GYHPV2L2L43KRMBK?v=spec.summary; Height: 0.55mm; Pins: 2; Temperature Coefficient: X5R; Voltage: 10V
D4-D9 = UBXH11-0000018: LED CHIP 0603 LOW CURRENT OSRAM 0.002A GREEN 2.2V 2mA; Manufacturer P/N: LG L29K-G2J1-24; Editor: johann.furrer; Released by: martin.grasse; Env: ROHS; Permitted Use: Volume Products; Perferred: PREF; Mfg P/N Status: Active; Mfg P/N Split: 100; Mfg P/N Released: Yes; Color: *; Part Number: UBXH11-0000018; Value: GREEN; Max Voltage: 2.2V; Max Current: 2mA; Size: 0603; Min Operating Temp: -40°C; Max Operating Temp: 85°C; Part Type: LED; Release Data: 2018-01-09 15:31:38.754561; UBX Wiki: https://wiki.u-blox.com/bin/view/Operations/PartDetails?index=20619; RefDes: DS; Manufacturer: Osram; Mfg P/N Datasheet: https://wiki.u-blox.com/bin/view/Generic/Docs/DocumentSummary?index=20620
D21 D23 D24 = 110-00019: ESD9B3.3ST5G; Part Name: Diode TVS 3.3V SOD-923; Part_Type: Diode; Manufacturer: ON Semiconductor; Item_Phase: Preliminary; Body Size: 0.8mm x 0.6mm; Component Mounting Type: SMT; Diode Type: TVS; Use in new designs: Yes; Voltage: 3.3V; Part Number: 110-00019; Manufacturer P/N: ESD9B3.3ST5G; Supplier 1: Digi-Key; Supplier Part Number 1: ESD9B3.3ST5GOSCT-ND; Arena Link: https://app.bom.com/a/4M5DJQ9Q9SR7DV4H?v=spec.summary; Height: 0.4mm; MFG Package: SOD-923; Package Type: SOD; Pins: 2
R43-R45 R47-R61 R63-R68 = UBXH18-0003002: RES THICK FILM CHIP 0402 0R 0 100mW; Manufacturer: KOA; Manufacturer P/N: RK73Z1ETTD; Tolerance: 0; Editor: charlotte.biber; Released by: peter.mueller; Env: ROHS; Permitted Use: Volume Products; Perferred: PREF; Mfg P/N Status: NRND; Mfg P/N Split: 100; Mfg P/N Released: Yes; Part Number: UBXH18-0003002; Max Power: 100mW; Part Type: Resistor; Release Data: 2012-06-05 09:49:55.978616; UBX Wiki: https://wiki.u-blox.com/bin/view/Operations/PartDetails?index=6611; RefDes: R; Manufacturer 2: YAGEO; Manufacturer P/N 2: 2322_705_91001_L; Mfg P/N Status 2: NRND; Mfg P/N Split 2: 0; Mfg P/N Released 2: Yes
R72-R76 R93 = UBXH18-0008041: RES THICK FILM CHIP 0402 470R 5% 100mW; Manufacturer: ROHM; Manufacturer P/N: MCR01MZPJ471; Editor: roland.rust; Env: ROHS; Permitted Use: Volume Products; Perferred: PREF; Mfg P/N Status: Active; Mfg P/N Split: 100; Mfg P/N Released: Yes; Part Number: UBXH18-0008041; Tolerance: 5%; Max Power: 100mW; Part Type: Resistor; Released by: roland.rust; Release Data: 2009-04-24 14:36:39; UBX Wiki: https://wiki.u-blox.com/bin/view/Operations/PartDetails?index=6926; RefDes: R; Manufacturer 2: KOA; Manufacturer P/N 2: RK73B1ETTP471J; Mfg P/N Status 2: Active; Mfg P/N Split 2: 0; Mfg P/N Released 2: Yes; Manufacturer 3: YAGEO; Manufacturer P/N 3: 2322_705_87471_L; Mfg P/N Status 3: NRND; Mfg P/N Split 3: 0; Mfg P/N Released 3: Yes
SW1 SW3 SW4 = 135-00002: Tactile Switch, SPST-NO, SMT, Actuation force = 160g, 6mm x 6mm; Part Name: Button Tactile SPST-NO 50mA 6mm SMT; Part_Type: Button; Manufacturer: C&K Components; Manufacturer P/N: PTS645SM43SMTR92 LFS; Item_Phase: Production; Current: 50mA; Switch/Button Circuit: SPST; Switch/Button Function: Off-Mom; Use in new designs: Yes; Voltage: 12VDC; Part Number: 135-00002; Supplier 1: Digi-Key; Supplier Part Number 1: CKN9112CT-ND; Arena Link: https://app.bom.com/a/L3MU07Q7Q98QQQW6?v=spec.summary; Body Size: 6mm x 6mm; Component Mounting Type: SMT; Height: 4.4mm; Pins: 4; Revision: 0B; Manufacturer 2: Seeed Technology; Manufacturer P/N 2: Rigado 135-00002; Supplier 2: Seeed Technology; Supplier Part Number 2: Rigado 135-00002
TP31 TP32 TP36-TP38 TP40 TP42 TP45-TP49 TP51-TP58 TP139 TP140 TP143 TP144 = TP10R: Testpoint, Round 1.0mm Dia; Added By: Jeremy D; Part Number: TP10R; Size: 1.0mm; Height: 0; DNP: DNP; Added Date: 2/1/2015; Checked By: Paul B; Checked Date: 2/5/2015
U3 U4 U7 = 225-00022: Buffer, Non-Inverting 2 Element 1 Bit per Element Push-Pull Output SC-70-6; Manufacturer 1: Texas Instruments; Manufacturer Part Number 1: SN74LVC2G34DCKR; Part Name: IC BUF NON-INVERT 5.5V SC70-6; Body Size: 1.25mm x 2mm; Item Phase: In Production; SMT Pitch: 0.65mm; Thermal Pad: No; Use in new designs: Yes; Voltage: 5.5V; UBX Code: None; Manufacturer P/N: *; Part Number: 225-00022; Supplier 1: Digi-Key; Supplier Part Number 1: 296-13497-1-ND; Height: 1.1mm; Logic Type: Buffer; MFG Package: SC-70-6; Max Operating Temp: 125; Min Operating Temp: -40; Pins: 6; Revision: 0A; Manufacturer 2: ON Semiconductor; Manufacturer Part Number 2: NC7WZ16P6X; Supplier 2: Digi-Key; Supplier Part Number 2: NC7WZ16P6XCT-ND
U102-U104 = UBXH10-0000036: TXS0108 8-BIT BIDIRECTIONAL VOLTAGE-LEVEL TRANSLATOR; Manufacturer: Texas Instruments; Editor: roland.rust; Released by: adam.johansson; Env: GREEN; Permitted Use: Support Products; Perferred: PREF; Mfg P/N Status: Active; Mfg P/N Split: 100; Mfg P/N Released: Yes; Part Number: UBXH10-0000036; Value: TXS0108EPWR; Min Operating Temp: -40°C; Max Operating Temp: 85°C; Part Type: Interface; Release Data: 2015-06-17T17:08:49; UBX Wiki: https://wiki.u-blox.com/bin/view/Operations/PartDetails?index=22749; RefDes: U; Manufacturer P/N: TXS0108EPWR; Mfg P/N Datasheet: https://wiki.u-blox.com/bin/view/Generic/Docs/DocumentSummary?index=22748

## Sheet EVK-NORA-W1_SCHEM_0002_Power.SchDoc
size B; Date: 7/24/2020; CompanyName: U-blox; DrawnBy: EMOO; Engineer: EMOO; Organization: U-blox; Address1: 3950 Fairview Industrial Dr SE #100; Address2: Salem, OR 97302; SheetNumber: 2; SheetTotal: 6; SheetSize: B; SheetTitle: Power
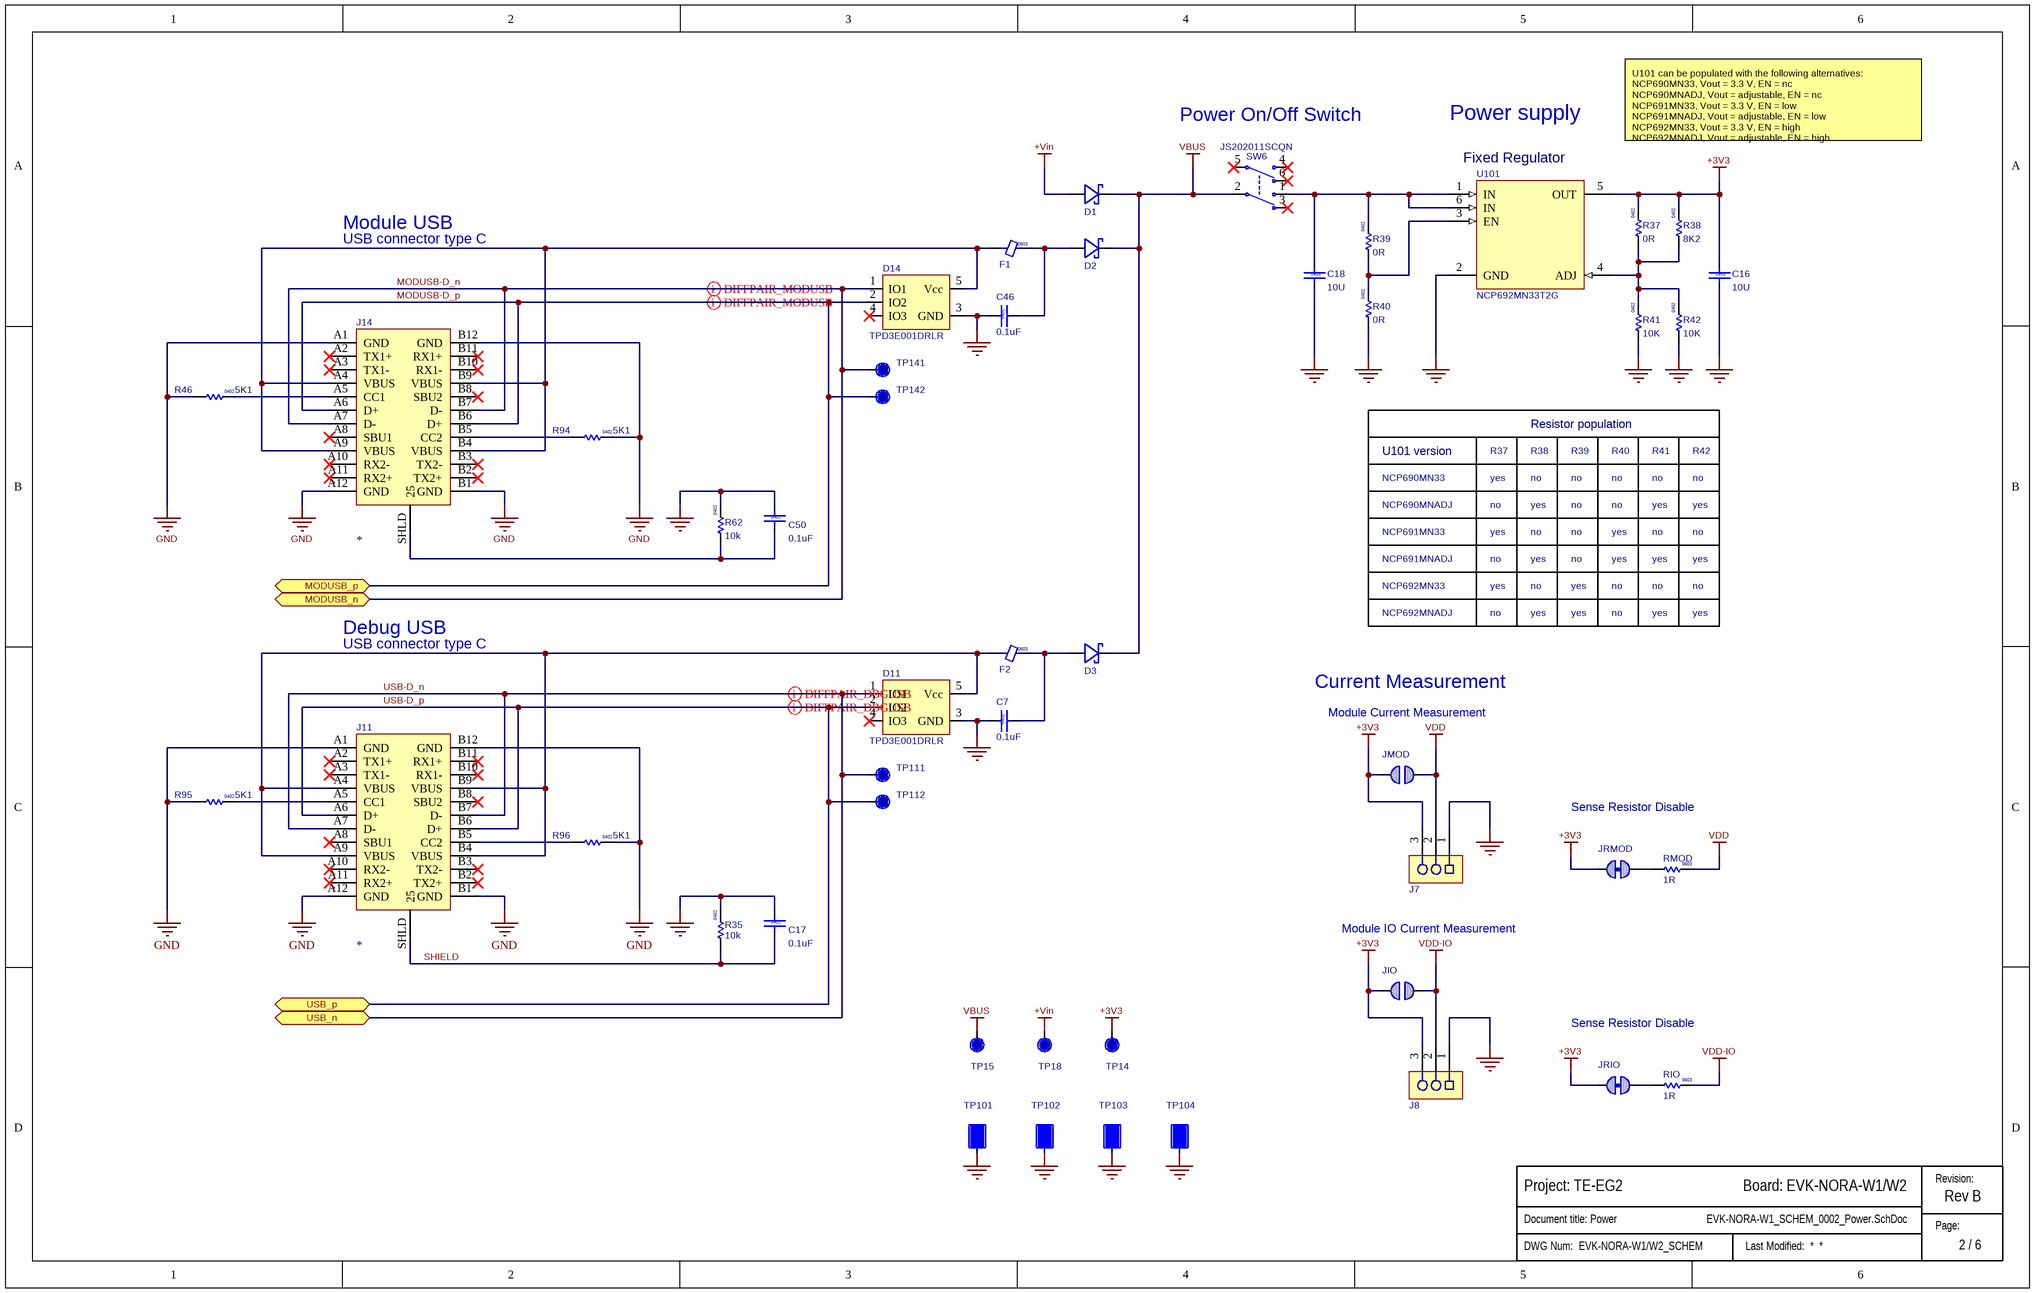
[diagram p5: EVK-NORA-W1_SCHEM_0002_Power.SchDoc]

### Parts
(Parts that share a designator on the sheet are numbered #1, #2 ... from top to bottom, then left to right.)
?#7  (no value)  (graphical)
C7  value 0.1uF  Size: 0402  [Cap 0402 HD]  (hidden comment: 120-000160.1uF)
C16  value 10U  Size: 0603  [Cap 0603 HD]
C17  value 0.1uF  Size: 0402  [Cap 0402 HD]  (hidden comment: 120-000160.1uF)
C18  value 10U  Size: 0603  [Cap 0603 HD]
C46  value 0.1uF  Size: 0402  [Cap 0402 HD]  (hidden comment: 120-000160.1uF)
C50  value 0.1uF  Size: 0402  [Cap 0402 HD]  (hidden comment: 120-000160.1uF)
D1  (no value)  [SOD-123F_U]
D2  (no value)  [SOD-123F_U]
D3  (no value)  [SOD-123F_U]
D11  Manufacturer P/N: TPD3E001DRLR  [SOT-553]  (hidden comment: 110-00018)
D14  Manufacturer P/N: TPD3E001DRLR  [SOT-553]  (hidden comment: 110-00018)
F1  Size: 0603  [IND 0603 HD]
F2  Size: 0603  [IND 0603 HD]
J7  130-00105  [HDR-0.1P-3Pin-1Row-SMT]  (value not drawn)
J8  130-00105  [HDR-0.1P-3Pin-1Row-SMT]  (value not drawn)
J11  (no value)  [CON_USB-C-RA_W-6Tabs]
J14  (no value)  [CON_USB-C-RA_W-6Tabs]
JIO  Solderbridge-OpenDNP  [Solderbridge-Open]  (value not drawn)  (no BOM)
JMOD  Solderbridge-OpenDNP  [Solderbridge-Open]  (value not drawn)  (no BOM)
JRIO  Solderbridge-ShortDNP  [Solderbridge-Short]  (value not drawn)  (net tie, no BOM)
JRMOD  Solderbridge-ShortDNP  [Solderbridge-Short]  (value not drawn)  (net tie, no BOM)
R35  value 10k  Size: 0402  [RES 0402 HD]  (hidden comment: 180-0002410k)
R37  value 0R  Size: 0402  [RES 0402 HD]
R38  value 8K2  Size: 0402  [RES 0402 HD]
R39  value 0R  Size: 0402  [RES 0402 HD]
R40  value 0R  Size: 0402  [RES 0402 HD]
R41  value 10K  Size: 0402  [RES 0402 HD]
R42  value 10K  Size: 0402  [RES 0402 HD]
R46  value 5K1  Size: 0402  [RES 0402 HD]
R62  value 10k  Size: 0402  [RES 0402 HD]  (hidden comment: 180-0002410k)
R94  value 5K1  Size: 0402  [RES 0402 HD]
R95  value 5K1  Size: 0402  [RES 0402 HD]
R96  value 5K1  Size: 0402  [RES 0402 HD]
RIO  value 1R  Size: 0603  [RES 0603 HD]  (hidden comment: 180-001091R)
RMOD  value 1R  Size: 0603  [RES 0603 HD]  (hidden comment: 180-001091R)
SW6  Manufacturer P/N: JS202011SCQN  [SW_Slide_DPDT_JS202011SCQN]  (hidden comment: 137-00006)
TP14  TP  [TP10R]  (value not drawn)  (no BOM)
TP15  TP  [TP10R]  (value not drawn)  (no BOM)
TP18  TP  [TP10R]  (value not drawn)  (no BOM)
TP101  TP4.5x3SqDNP  [TP4.5x3Sq]  (value not drawn)  (no BOM)
TP102  TP4.5x3SqDNP  [TP4.5x3Sq]  (value not drawn)  (no BOM)
TP103  TP4.5x3SqDNP  [TP4.5x3Sq]  (value not drawn)  (no BOM)
TP104  TP4.5x3SqDNP  [TP4.5x3Sq]  (value not drawn)  (no BOM)
TP111  TP  [TP10R]  (value not drawn)  (no BOM)
TP112  TP  [TP10R]  (value not drawn)  (no BOM)
TP141  TP  [TP10R]  (value not drawn)  (no BOM)
TP142  TP  [TP10R]  (value not drawn)  (no BOM)
U101  NCP692MN33T2G  [DFN-PSON.1P3X3-7pin_HS-7N]

### Ports
MODUSB_n (bidir), MODUSB_p (bidir), USB_n (bidir), USB_p (bidir)

### Nets
+3V3: C16.1 J7.3 J8.3 JIO.2 JMOD.2 JRIO.2 JRMOD.2 R37.2 R38.2 TP14.1 U101.5(OUT)
+Vin: D1.A(Anode) TP18.1
GND: C7.1 C16.2 C17.1 C18.2 C46.1 C50.1 D11.3(GND) D14.3(GND) J7.1 J8.1 J11.A1(GND) J11.A12(GND) J11.B1(GND) J11.B12(GND) J14.A1(GND) J14.A12(GND) J14.B1(GND) J14.B12(GND) R35.2 R40.1 R41.1 R42.1 R46.1 R62.2 R94.2 R95.1 R96.2 TP101.1 TP102.1 TP103.1 TP104.1 U101.2(GND)
VBUS: D1.C(Cathode) D2.C(Cathode) D3.C(Cathode) SW6.2(COM-1) TP15.1
VDD: J7.2 JMOD.1 RMOD.2
VDD-IO: J8.2 JIO.1 RIO.2
MODUSB-D_n: D14.1(IO1) J14.A7(D-) J14.B7(D-) TP141.1 ; port MODUSB_n
MODUSB-D_p: D14.2(IO2) J14.A6(D+) J14.B6(D+) TP142.1 ; port MODUSB_p
SHIELD: C17.2 J11.SHLD(25) R35.1
USB-D_n: D11.1(IO1) J11.A7(D-) J11.B7(D-) TP111.1 ; port USB_n
USB-D_p: D11.2(IO2) J11.A6(D+) J11.B6(D+) TP112.1 ; port USB_p
NetC7_2: C7.2 D3.A(Anode) F2.2
NetC18_1: C18.1 R39.2 SW6.1(N.O-1) U101.1(IN) U101.6(IN)
NetC46_2: C46.2 D2.A(Anode) F1.2
NetC50_2: C50.2 J14.SHLD(25) R62.1
NetD11_5: D11.5(Vcc) F2.1 J11.A4(VBUS) J11.A9(VBUS) J11.B4(VBUS) J11.B9(VBUS)
NetD14_5: D14.5(Vcc) F1.1 J14.A4(VBUS) J14.A9(VBUS) J14.B4(VBUS) J14.B9(VBUS)
NetJ11_A5: J11.A5(CC1) R95.2
NetJ11_B5: J11.B5(CC2) R96.1
NetJ14_A5: J14.A5(CC1) R46.2
NetJ14_B5: J14.B5(CC2) R94.1
NetJRIO_1: JRIO.1 RIO.1
NetJRMOD_1: JRMOD.1 RMOD.1
NetR37_1: R37.1 R38.1 R41.2 R42.2 U101.4(ADJ)
NetR39_1: R39.1 R40.2 U101.3(EN)

Not connected (* = marked no-connect by the designer): D11 4(IO3)*; D14 4(IO3)*; J11 A2(TX1+)* A3(TX1-)* A8(SBU1)* A10(RX2-)* A11(RX2+)* B2(TX2+)* B3(TX2-)* B8(SBU2)* B10(RX1-)* B11(RX1+)*; J14 A2(TX1+)* A3(TX1-)* A8(SBU1)* A10(RX2-)* A11(RX2+)* B2(TX2+)* B3(TX2-)* B8(SBU2)* B10(RX1-)* B11(RX1+)*; SW6 3(N.C-1)* 4(N.O-2)* 5(COM-2)* 6(N.C-2)*

### Layout directives
differential pair; net class USB_DIFF: MODUSB-D_n, MODUSB-D_p, USB-D_n, USB-D_p

### Notes on the sheet
- (near SW6) Power On/Off Switch
- Power supply
- (near U101) Fixed Regulator
- U101 can be populated with the following alternatives:
  NCP690MN33, Vout = 3.3 V, EN = nc
  NCP690MNADJ, Vout = adjustable, EN = nc
  NCP691MN33, Vout = 3.3 V, EN = low
  NCP691MNADJ, Vout = adjustable, EN = low
  NCP692MN33, Vout = 3.3 V, EN = high
  NCP692MNADJ, Vout = adjustable, EN = high
- Module USB
- USB connector type C
- Resistor population
- NCP690MN33
- NCP690MNADJ
- U101 version
- R37
- yes
- no
- R38
- R39
- R40
- R41
- R42
- NCP691MN33
- NCP691MNADJ
- Debug USB
- NCP692MN33
- NCP692MNADJ
- Current Measurement
- Module Current Measurement
- Sense Resistor Disable
- Module IO Current Measurement
- Revision:
- Page:

### Library data of the parts
?#7 = Sub_Title_Block: as ?#6 on sheet EVK-NORA-W1_SCHEM_0005_Interface_Isolation
C7 C17 C46 C50 = 120-00016: as C19 on sheet EVK-NORA-W1_SCHEM_0005_Interface_Isolation; Part Number: 120-00016; Revision: 0A; Supplier 1: Digi-Key; Supplier Part Number 1: 490-6297-1-ND; Manufacturer 2: Yageo; Manufacturer P/N 2: CC0402KRX5R6BB104; Supplier 2: Digi-Key; Supplier Part Number 2: 311-1336-1-ND; Arena Link: https://app.bom.com/a/GYHPV2L2L43KRMBK?v=spec.summary; Height: 0.55mm; Pins: 2; Temperature Coefficient: X5R; Voltage: 10V
C16 C18 = UBXH01-0000310: CAP CER X7R 0603 10U 20% 10V; Manufacturer: Murata Manufacturing Company, Ltd.; Manufacturer P/N: GRM188Z71A106MA73; Editor: michael.hein; Released by: martin.grasse; Env: ROHS; Permitted Use: Volume Products; Perferred: PREF; Mfg P/N Status: Active; Mfg P/N Split: 100; Mfg P/N Released: Yes; Part Number: UBXH01-0000310; Tolerance: 20%; Max Voltage: 10V; Min Operating Temp: -55°C; Max Operating Temp: 125°C; Part Type: Capacitor; Release Data: 2017-02-09 11:14:05.871832; UBX Wiki: https://wiki.u-blox.com/bin/view/Operations/PartDetails?index=26280; RefDes: C; Mfg P/N Datasheet: https://wiki.u-blox.com/bin/view/Generic/Docs/DocumentSummary?index=26282; Manufacturer 2: Murata Manufacturing Company, Ltd.; Manufacturer P/N 2: GRM188Z71A106KA73; Mfg P/N Status 2: Active; Mfg P/N Split 2: 0; Mfg P/N Released 2: Yes; Mfg P/N Datasheet 2: https://wiki.u-blox.com/bin/view/Generic/Docs/DocumentSummary?index=28416
D1-D3 = 110-00005: Diode, Schottky, 20V 1A SOD-123F, 340mV Vf @ 1A / MBR120VLSFT3G; Manufacturer 1: ON Semiconductor; Part Name: Diode Schottky 20V 1A SOD-123FL; Body Size: None; Item Phase: In Production; MFG Package: SOD-123FL; Use in new designs: Yes; Part Number: 110-00005; Manufacturer Part Number 1: MBR120VLSFT3G; Supplier 1: Digi-Key; Supplier Part Number 1: MBR120VLSFT3GOSCT-ND; Manufacturer 2: None; Manufacturer Part Number 2: None; Supplier 2: None; Supplier Part Number 2: None; Current: 1A; Height: 0.98mm; Max Operating Temp: 125; Min Operating Temp: -65; Pins: 2; Revision: 0B; Voltage: 20V; UBX Code: None
D11 D14 = 110-00018: LOW-CAPACITANCE 3-CHANNEL ESD-PROTECTION ARRAY; Part Name: TVS Diode, 3CH High Speed ESD; Part_Type: Diode; Manufacturer: Texas Instruments; Item_Phase: Production; Body Size: 1.6mm x 1.2mm; Component Mounting Type: SMT; Diode Type: TVS; Use in new designs: Yes; Voltage: 5V; Part Number: 110-00018; Revision: 0A; Supplier 1: Digi-Key; Supplier Part Number 1: 296-21885-1-ND; Arena Link: https://app.bom.com/a/UCV39GZGZIHX50AE?v=spec.summary; Height: .55mm; MFG Package: SOT-553; Package Type: SOT; Pins: 5
F1 F2 = UBXH08-0000001: FERRITE BEAD 0603 600 OHM AT 100MHZ 600OHM 500mA; Manufacturer: TDK Corporation; Manufacturer P/N: MMZ1608B601C; Editor: daniel.hurni; Released by: martin.frauchiger; Env: ROHS; Permitted Use: Support Products; Perferred: PREF; Mfg P/N Status: Active; Mfg P/N Split: 100; Mfg P/N Released: Yes; Part Number: UBXH08-0000001; Value: 600OHM; Max Current: 500mA; Min Operating Temp: -40°C; Max Operating Temp: 125°C; Part Type: Ferrite; Release Data: 2009-12-02 10:18:36.177919; UBX Wiki: https://wiki.u-blox.com/bin/view/Operations/PartDetails?index=7960; RefDes: FB; Mfg P/N Datasheet: https://wiki.u-blox.com/bin/view/Generic/Docs/DocumentSummary?index=7941
J7 J8 = 130-00105: Header, 0.100" Pitch, 3 Pin, Vertical SMT; Manufacturer P/N: M20-8770342; Part Name: CON HDR 0.1" 3 Pin SMT; Part_Type: Connector; Manufacturer: Harwin Inc; Item_Phase: Preliminary; Keyed: No; Rows: 1; Use in new designs: Yes; Part Number: 130-00105; Supplier 1: Digi-Key; Supplier Part Number 1: 952-1951-ND; Arena Link: https://app.bom.com/a/BTCKQXGXGZYCIWHE?v=spec.summary; Color: Black; Component Mounting Type: SMT; Connector Type: Header; Height: 9.93mm; Length: 7.62mm; Locking: No; Pin Pitch: 0.100"; Pins: 3; Width: 5.08mm
J11 J14 = 130-00150: Connector, USB-C Receptacle, 24 Position, Surface Mount, Right Angle, Horizontal, 20V; Manufacturer 1: JAE Electronics; Manufacturer Part Number 1: DX07S024JJ3R1300; Part Name: CON USB C 0.5 mm 24 Pin 2 Row Right Angle White; Item Phase: Unreleased; Use in new designs: Yes; UBX Code: None; Manufacturer P/N: *; Part Number: 130-00150; Supplier 1: Digi-Key; Supplier Part Number 1: 670-2846-1-ND; Diameter: None; Height: 3.29mm; Max Operating Temp: 80; Min Operating Temp: -30; Pins: 24; Revision: None; Voltage: 20V; Manufacturer 2: None; Manufacturer Part Number 2: None; Supplier 2: None; Supplier Part Number 2: None
JIO JMOD = Solderbridge-Open: Added By: Paul B; Part Number: Solderbridge-Open; Height: 0; DNP: DNP; Added Date: 12/2/2015
JRIO JRMOD = Solderbridge-Short: Added By: Paul B; Part Number: Solderbridge-Short; Height: 0; DNP: DNP; Added Date: 12/2/2015
R35 R62 = 180-00024: Resistor 10k ohm 1% 1/16W, 0402; Part Name: RES SMD 10K OHM 1% 1/16W 0402; Manufacturer: Rohm Semiconductor; Manufacturer P/N: MCR01MRTF1002; Item_Phase: Production; Component Mounting Type: SMT; Tolerance: +/- 1%; Use in new designs: Yes; Part Number: 180-00024; Part_Type: Resistor; Revision: 0A; Supplier 1: Digi-Key; Supplier Part Number 1: RHM10.0KCDCT-ND; Manufacturer 2: Samsung Electro-Mechanics America, Inc; Manufacturer P/N 2: RC1005F103CS; Arena Link: https://app.bom.com/a/0I19FM5M5ON4B4RQ?v=spec.summary; Height: 0.4mm; Pins: 2; Power: 1/16W; Voltage: N/A
R37 R39 R40 = UBXH18-0003002: as R43-R45 on sheet EVK-NORA-W1_SCHEM_0005_Interface_Isolation; Part Number: UBXH18-0003002; Max Power: 100mW; Part Type: Resistor; Release Data: 2012-06-05 09:49:55.978616; UBX Wiki: https://wiki.u-blox.com/bin/view/Operations/PartDetails?index=6611; RefDes: R; Manufacturer 2: YAGEO; Manufacturer P/N 2: 2322_705_91001_L; Mfg P/N Status 2: NRND; Mfg P/N Split 2: 0; Mfg P/N Released 2: Yes
R38 = UBXH18-0000138: RES THICK FILM CHIP 0402 8K2 1% 63mW; Manufacturer: Vishay; Manufacturer P/N: CRCW04028K20FKED; Editor: matej.budin; Released by: pasquale.scorca; Env: ROHS; Permitted Use: Support Products; Perferred: PREF; Mfg P/N Status: Active; Mfg P/N Split: 100; Mfg P/N Released: Yes; Part Number: UBXH18-0000138; Tolerance: 1%; Max Power: 63mW; Min Operating Temp: -55°C; Max Operating Temp: 125°C; Part Type: Resistor; Release Data: 2014-08-26 11:33:33.796911; UBX Wiki: https://wiki.u-blox.com/bin/view/Operations/PartDetails?index=21078; RefDes: R; Mfg P/N Datasheet: https://wiki.u-blox.com/bin/view/Generic/Docs/DocumentSummary?index=21077
R41 R42 = UBXH18-0000065: RES THICK FILM CHIP 0402 10K 1% 63mW; Manufacturer: KOA; Manufacturer P/N: RK73H1ETTP1002F; Editor: erian.bezhani; Released by: massimo.vlacci; Env: ROHS; Permitted Use: Volume Products; Perferred: PREF; Mfg P/N Status: Active; Mfg P/N Split: 100; Mfg P/N Released: Yes; Part Number: UBXH18-0000065; Tolerance: 1%; Max Power: 63mW; Part Type: Resistor; Release Data: 2012-06-08 18:02:21.521517; UBX Wiki: https://wiki.u-blox.com/bin/view/Operations/PartDetails?index=16837; RefDes: R; Mfg P/N Datasheet: https://wiki.u-blox.com/bin/view/Generic/Docs/DocumentSummary?index=8222
R46 R94-R96 = UBXH18-0008066: RES THICK FILM CHIP 0402 5K1 5% 100mW; Manufacturer: Panasonic; Manufacturer P/N: ERJ-2GEJ512X; Editor: alvaro.nussbaum; Released by: roland.rust; Env: ROHS; Permitted Use: Internal Use; Perferred: NONPREF; Mfg P/N Status: Active; Mfg P/N Split: 100; Mfg P/N Released: No; Part Number: UBXH18-0008066; Tolerance: 5%; Max Power: 100mW; Part Type: Resistor; Release Data: 2016-02-11T15:22:01; UBX Wiki: https://wiki.u-blox.com/bin/view/Operations/PartDetails?index=6972; RefDes: R
RIO RMOD = 180-00109: Resistor 1 ohm 1%, 1/10W, 0603; Part Name: RES SMD 1 OHM 1% 1/10W 0603; Manufacturer: Samsung Electro-Mechanics America, Inc; Manufacturer P/N: RC1608F1R0CS; Item_Phase: Preliminary; Component Mounting Type: SMT; Tolerance: +/- 1%; Use in new designs: Yes; Part Number: 180-00109; Part_Type: Resistor; Supplier 1: Digi-Key; Supplier Part Number 1: 1276-4471-1-ND; Manufacturer 2: Yageo; Manufacturer P/N 2: RC0603FR-071RP; Supplier 2: Digi-Key; Supplier Part Number 2: YAG1295CT-ND; Arena Link: https://app.bom.com/a/Q8RZ5CVCVEDTXJ3Q?v=spec.summary; Height: 0.55mm; Pins: 2; Power: 1/10W
SW6 = 137-00006: SWITCH SLIDE DPDT 300MA 6V SMD; Manufacturer: C&K Components; Item_Phase: Preliminary; Component Mounting Type: SMT; Switch/Button Function: On-On; Use in new designs: Yes; Part Number: 137-00006; Part Name: SWITCH SLIDE DPDT 300MA 6V SMD; Part_Type: Switch; Supplier 1: Digi-Key; Supplier Part Number 1: 401-2002-1-ND; Arena Link: https://app.bom.com/a/5N6EKRARATS6M48O?v=spec.summary; Color: Silver; Current: 300mA; Height: 5.5mm; Length: 9mm; Pins: 6; Switch/Button Circuit: DPDT; Voltage: 6V; Width: 3.6mm
TP14 TP15 TP18 TP111 TP112 TP141 TP142 = TP10R: as TP31 on sheet EVK-NORA-W1_SCHEM_0005_Interface_Isolation; Part Number: TP10R; Size: 1.0mm; Height: 0; DNP: DNP; Added Date: 2/1/2015; Checked By: Paul B; Checked Date: 2/5/2015
TP101-TP104 = TP4.5x3Sq: Testpoint, Rectangular 4.5mm x 3mm; Added By: Jeremy D; Part Number: TP4.5x3Sq; Size: 4.5mm x 3mm; Height: 0; DNP: DNP; Added Date: 8/21/2015
U101 = UBXH12-0000459: LOW DROPOUT REGULATOR ON SEMICONDUCTOR NCP692MN33T2G 6DFN 3.3V 6V 1A; Editor: hakan.ekfors; Released by: markus.wejrot; Env: ROHS; Permitted Use: Volume Products; Perferred: PREF; Mfg P/N Status: Active; Mfg P/N Split: 100; Mfg P/N Released: Yes; Part Number: UBXH12-0000459; Value: 3.3V; Max Voltage: 6V; Max Current: 1A; Min Operating Temp: -40°C; Max Operating Temp: 125°C; Part Type: Regulator; Release Data: 2021-08-23 15:14:48.502500; UBX Wiki: https://wiki.u-blox.com/bin/view/Operations/PartDetails?index=35423; RefDes: U; Manufacturer: ON Semiconductor; Manufacturer P/N: NCP692MN33T2G; Mfg P/N Datasheet: https://wiki.u-blox.com/bin/view/Generic/Docs/DocumentSummary?index=35425